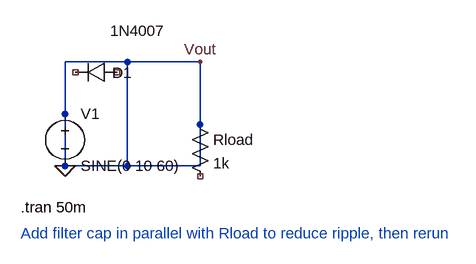
[diagram p0: schematic 07_halfwave_rectifier.asc]
07_halfwave_rectifier.asc, the LTspice schematic file:
Version 4
SHEET 1 880 680
WIRE 224 96 128 96
WIRE 336 96 224 96
WIRE 128 176 128 96
WIRE 224 176 224 96
WIRE 336 176 336 96
WIRE 128 256 128 176
WIRE 224 256 224 176
WIRE 224 256 128 256
WIRE 336 256 336 176
WIRE 336 256 224 256
FLAG 128 256 0
FLAG 336 96 Vout
SYMBOL voltage 128 160 R0
SYMATTR InstName V1
SYMATTR Value SINE(0 10 60)
SYMBOL diode 208 96 R90
WINDOW 0 32 -8 VBottom 2
WINDOW 3 -32 -32 VBottom 2
SYMATTR InstName D1
SYMATTR Value 1N4007
SYMBOL res 320 176 R0
SYMATTR InstName Rload
SYMATTR Value 1k
TEXT 60 320 Left 2 !.tran 50m
TEXT 60 360 Left 2 ;Add filter cap in parallel with Rload to reduce ripple, then rerun

The netlist it stands for:
* 07_halfwave_rectifier.asc
V1 0 0 SINE(0 10 60)
D1 NC_01 NC_02 1N4007
Rload 0 NC_03 1k
.model D D
.lib standard.dio
.tran 50m
* Add filter cap in parallel with Rload to reduce ripple, then rerun
.backanno
.end